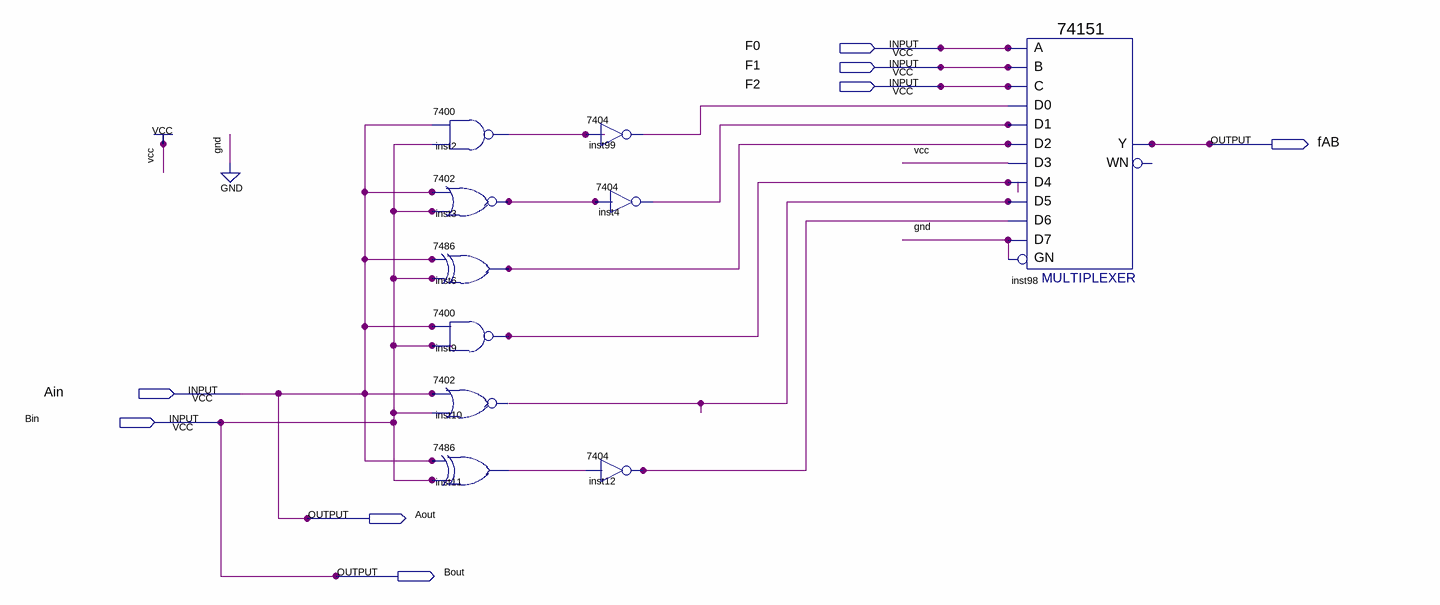
[diagram p0: schematic sheet]
// Quartus schematic computation_unit.bdf as structural Verilog: 10 symbols, 8 pins
module computation_unit (
  input  F0,
  input  F1,
  input  F2,
  input  Ain,
  input  Bin,
  output fAB,
  output Aout,
  output Bout
);

  wire inst2_1, inst3_1, inst4_1, inst6_1, inst9_1, inst10_1, inst11_1, inst12_1, inst99_1;

  \7400  inst2 (.\3 (Bin), .\2 (Ain), .\1 (inst2_1));
  \7402  inst3 (.\2 (Ain), .\3 (Bin), .\1 (inst3_1));
  \7486  inst6 (.\2 (Ain), .\3 (Bin), .\1 (inst6_1));
  \7400  inst9 (.\3 (Bin), .\2 (Ain), .\1 (inst9_1));
  \7402  inst10 (.\2 (Ain), .\3 (Bin), .\1 (inst10_1));
  \7486  inst11 (.\2 (Ain), .\3 (Bin), .\1 (inst11_1));
  \7404  inst99 (.\2 (inst2_1), .\1 (inst99_1));
  \7404  inst4 (.\2 (inst3_1), .\1 (inst4_1));
  \7404  inst12 (.\2 (inst11_1), .\1 (inst12_1));
  \74151  inst98 (
    .GN(1'b0), .C(F2), .B(F1), .A(F0), .D5(inst10_1), .D0(inst99_1), .D1(inst4_1), .D4(inst9_1), .D3(1'b1),
    .D2(inst6_1), .D6(inst12_1), .D7(1'b0), .Y(fAB));  // open: WN

  assign Aout = Ain;
  assign Bout = Bin;
endmodule
